# Altium schematic sheet LTC6655CHMS8-5#TRPBF_2020-12-23_22-11-42.schdoc
size 59 x 35 mm
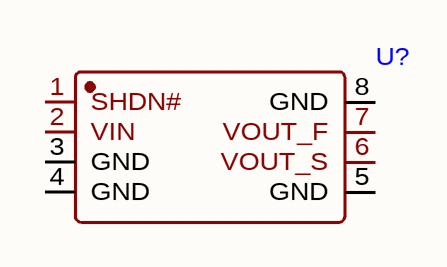
[diagram p0: LTC6655CHMS8-5#TRPBF_2020-12-23_22-11-42.schdoc]

## Parts
U?  (no value)  [MSOP-8_L3.0-W3.0-P0.65-LS4.9-BL]

## Nets

Not connected (* = marked no-connect by the designer): U? 1(SHDN#) 2(VIN) 3(GND) 4(GND) 5(GND) 6(VOUT_S) 7(VOUT_F) 8(GND)

## Library data of the parts
U? = LTC6655CHMS8-5#TRPBF